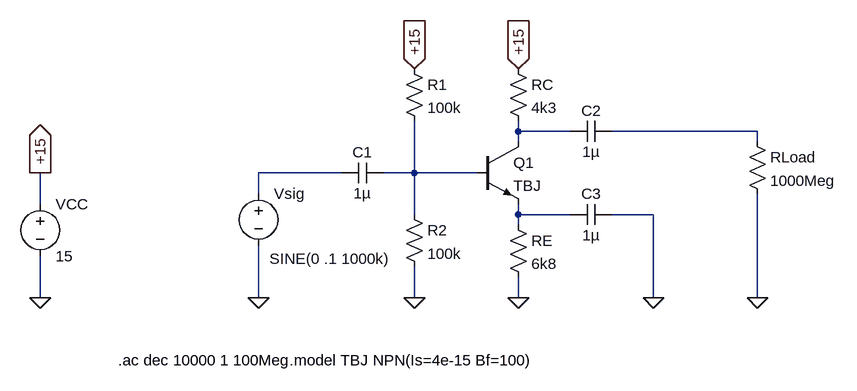
[diagram p0: schematic TBJ - Emissor Comum.asc]
TBJ - Emissor Comum.asc, the LTspice schematic file:
Version 4
SHEET 1 916 680
WIRE 416 48 416 32
WIRE 496 48 416 48
WIRE 784 48 560 48
WIRE 416 64 416 48
WIRE 784 64 784 48
WIRE 144 112 16 112
WIRE 256 112 256 32
WIRE 256 112 208 112
WIRE 352 112 256 112
WIRE 16 144 16 112
WIRE -320 160 -320 112
WIRE 256 176 256 112
WIRE 416 176 416 160
WIRE 496 176 416 176
WIRE 624 176 560 176
WIRE 416 192 416 176
WIRE -320 304 -320 240
WIRE 16 304 16 224
WIRE 256 304 256 256
WIRE 416 304 416 272
WIRE 624 304 624 176
WIRE 784 304 784 144
FLAG 16 304 0
FLAG 256 304 0
FLAG 416 304 0
FLAG -320 304 0
FLAG -320 112 +15
IOPIN -320 112 Out
FLAG 256 -48 +15
IOPIN 256 -48 In
FLAG 416 -48 +15
IOPIN 416 -48 In
FLAG 624 304 0
FLAG 784 304 0
SYMBOL voltage 16 128 R0
WINDOW 3 17 116 Left 2
WINDOW 39 0 0 Left 0
SYMATTR Value SINE(0 .1 1000k)
SYMATTR InstName Vsig
SYMATTR Value2 AC 1
SYMBOL cap 208 96 R90
WINDOW 0 0 32 VBottom 2
WINDOW 3 32 32 VTop 2
SYMATTR InstName C1
SYMATTR Value 1µ
SYMBOL npn 352 64 R0
SYMATTR InstName Q1
SYMATTR Value TBJ
SYMBOL res 240 -64 R0
SYMATTR InstName R1
SYMATTR Value 100k
SYMBOL res 240 160 R0
SYMATTR InstName R2
SYMATTR Value 100k
SYMBOL res 400 176 R0
SYMATTR InstName RE
SYMATTR Value 6k8
SYMBOL res 400 -64 R0
SYMATTR InstName RC
SYMATTR Value 4k3
SYMBOL cap 560 32 R90
WINDOW 0 0 32 VBottom 2
WINDOW 3 32 32 VTop 2
SYMATTR InstName C2
SYMATTR Value 1µ
SYMBOL cap 560 160 R90
WINDOW 0 0 32 VBottom 2
WINDOW 3 32 32 VTop 2
SYMATTR InstName C3
SYMATTR Value 1µ
SYMBOL voltage -320 144 R0
SYMATTR InstName VCC
SYMATTR Value 15
SYMBOL res 768 48 R0
SYMATTR InstName RLoad
SYMATTR Value 1000Meg
TEXT 64 400 Left 2 !.model TBJ NPN(Is=4e-15 Bf=100)
TEXT -200 400 Left 2 !.ac dec 10000 1 100Meg

The netlist it stands for:
* TBJ - Emissor Comum.asc
Vsig N003 0 SINE(0 .1 1000k) AC 1
C1 N004 N003 1µ
Q1 N001 N004 N005 0 TBJ
R1 +15 N004 100k
R2 N004 0 100k
RE N005 0 6k8
RC +15 N001 4k3
C2 N002 N001 1µ
C3 0 N005 1µ
VCC +15 0 15
RLoad N002 0 1000Meg
.model NPN NPN
.model PNP PNP
.lib standard.bjt
.model TBJ NPN(Is=4e-15 Bf=100)
.ac dec 10000 1 100Meg
.backanno
.end